# EasyEDA Pro project fan_2024-11-08_no1.eprj

# Schematic Schematic1
Board Name: Board1; Create Date: 2024-11-08; Page Name: P1; Project Name: fan_2024-11-08_no1; Schematic Name: Schematic1; Update Date: 2024-11-09; Company: 嘉立创EDA; Page Size: A4; Version: V1.0
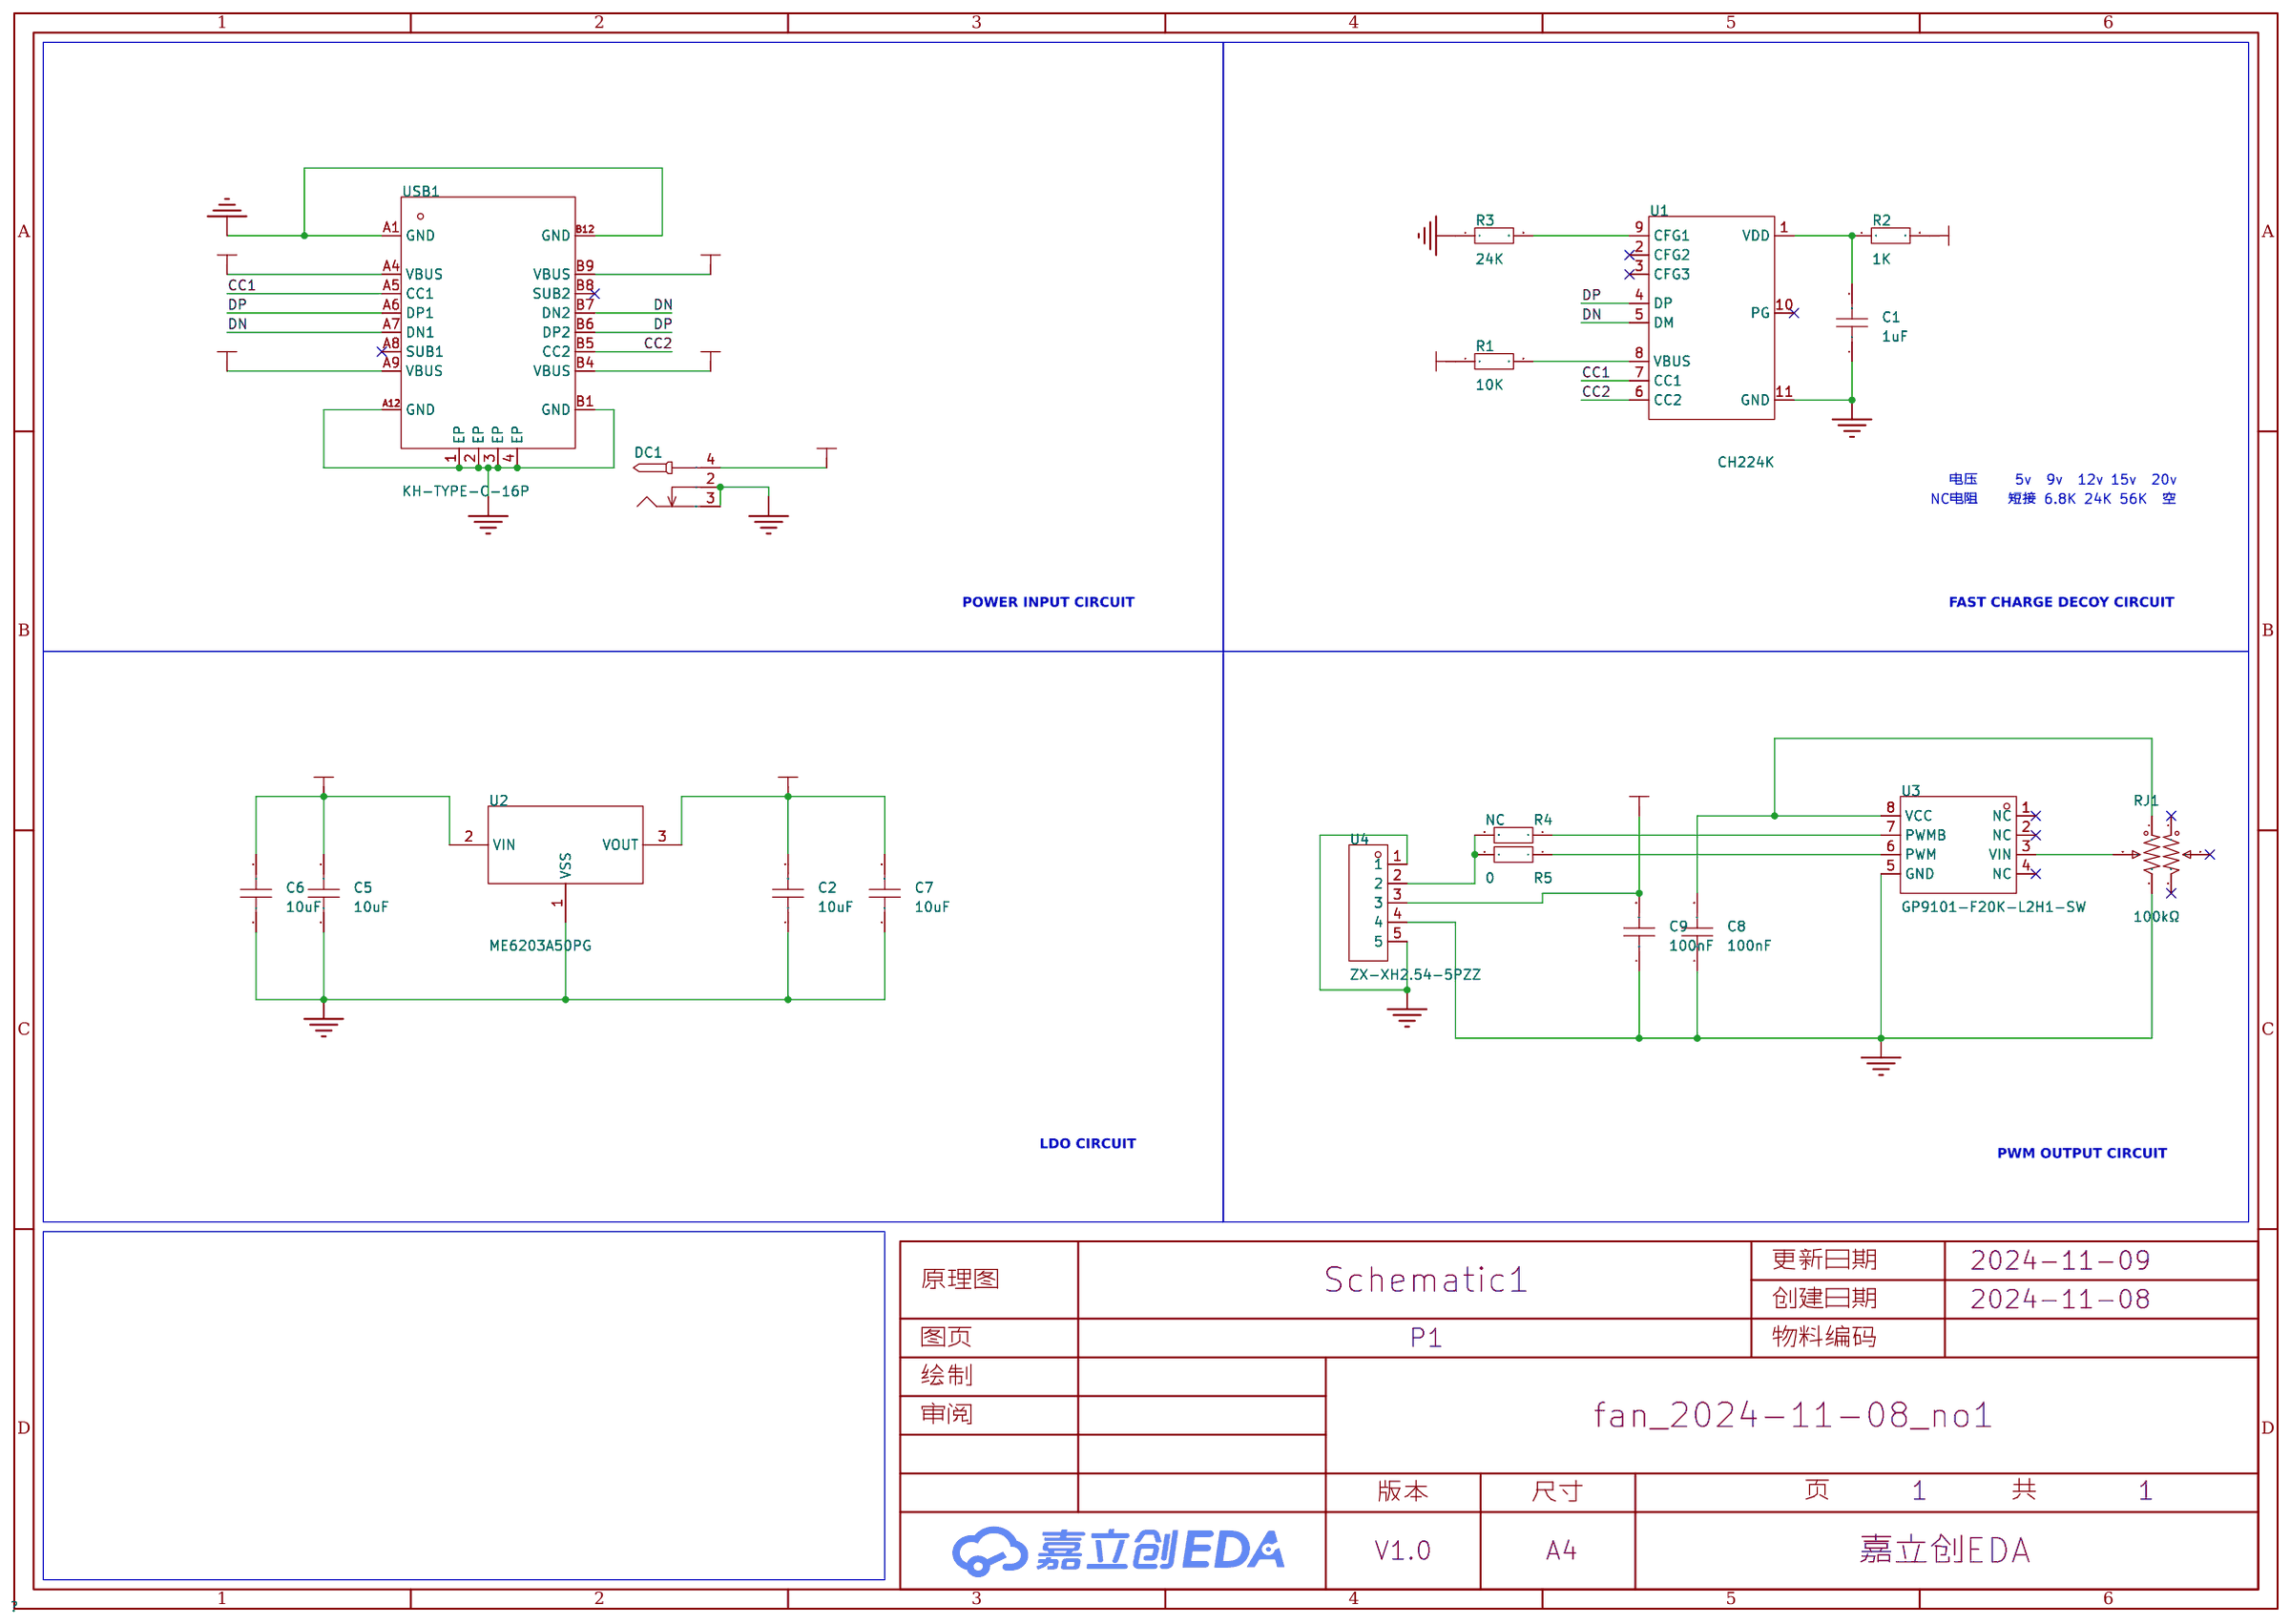
[diagram p0: schematic sheet]

## Parts
C1  1uF  [C0603]
C2  10uF  [C0603]
C5  10uF  [C0603]
C6  10uF  [C0603]
C7  10uF  [C0603]
C8  100nF  [C0603]
C9  100nF  [C0603]
DC1  -  [DC-2.0]
R1  10K  [R0603]
R2  1K  [R0603]
R3  24K  [R0603]
R4  NC  [R0603]
R5  0  [R0603]
RJ1  100kΩ  [RES-ADJ-TH_P092N-FC25CR100K]
U1  CH224K  [ESSOP-10_L4.9-W3.9-P1.0-LS6.0-TL-EP]
U2  ME6203A50PG  [SOT-89_L4.5-W2.5-P1.50-LS4.2-BR]
U3  GP9101-F20K-L2H1-SW  [SOP-8_L5.0-W3.9-P1.27-LS6.0-BL]
U4  ZX-XH2.54-5PZZ  [CONN-TH_5P-P2.50_ZX-XH2.54-5PZZ]
USB1  KH-TYPE-C-16P  [USB-C-SMD_KH-TYPE-C-16P]

## Library data of the parts
C1 C2 C5-C9 = CAP_0603: Supplier Footprint: 0603
DC1 = DC-005_2.0: Supplier Footprint: 插件
R1-R5 = Res_0603: Supplier Footprint: 0603
RJ1 = P092N-FC25CR100K: 阻值:100kΩ;精度:±20%;功率:25mW;; LCSC Part Name: 100kΩ ±20%; Supplier Part: C5840161; Manufacturer: TT Electronics; JLCPCB Part Class: 扩展库; Datasheet: https://atta.szlcsc.com/upload/public/pdf/source/231023/C17276885-5f2621a93e6f587478ebfbf97ba7ec06.pdf; Supplier: LCSC; Tolerance: ±20%; Power(Watts): 25mW; Turns: 1
U1 = CH224K: 应用功能:USB充电芯片;; LCSC Part Name: USB PD等多快充协议受电芯片CH224; Supplier Part: C970725; Manufacturer: WCH(南京沁恒); Supplier Footprint: ESSOP-10-150mil-1mm; JLCPCB Part Class: 扩展库; Datasheet: https://atta.szlcsc.com/upload/public/pdf/source/20240313/43C2AFDDBDD1F65B60386D2CCAB0811B.pdf; Supplier: LCSC; Applications Function: USB充电芯片
U2 = ME6203A50PG: 输出类型:固定;最大输入电压:30V;输出电压:5V;最大输出电流:100mA;电源纹波抑制比(PSRR):40dB@(1kHz);输出极性:正极;; LCSC Part Name: 输入30V 输出5V 100mA; Supplier Part: C94056; Manufacturer: MICRONE(南京微盟); Supplier Footprint: SOT-89; JLCPCB Part Class: 扩展库; Datasheet: https://atta.szlcsc.com/upload/public/pdf/source/20170116/1484561288466.pdf; Supplier: LCSC; Output Type: 固定; Maximum Input Voltage: 30V; Output Voltage: 5V; MAX Output Current: 100mA; Power Supply Rejection Ratio (PSRR): 40dB@(1kHz); Output Polarity: 正极; Number of Outputs: 1
U3 = GP9101-F20K-L2H1-SW: LCSC Part Name: 模拟信号转PWM信号; Supplier Part: C2837710; Manufacturer: Guestgood(客益); Supplier Footprint: SOP-8; JLCPCB Part Class: 扩展库; Datasheet: https://atta.szlcsc.com/upload/public/pdf/source/20230324/347DFD6DABD5C2E507926BD64C336E27.pdf; Supplier: LCSC
U4 = ZX-XH2.54-5PZZ: 插针结构:1x5P;间距:2.54mm;安装方式:直插;参考系列:XH;总PIN数:5P;排数:1;每排PIN数:5;行距:-;额定电流:3A;触头材质:黄铜;触头镀层:锡;工作温度范围:-25℃~+85℃;; Supplier Part: C7429635; Manufacturer: Megastar(兆星); Supplier Footprint: 插件,P=2.54mm; JLCPCB Part Class: 扩展库; Datasheet: https://atta.szlcsc.com/upload/public/pdf/source/20230619/60EEF4ADD558E90BFFACF5D939816781.pdf; Supplier: LCSC; Pins Structure: 1x5P; Pitch: 2.54mm; Mounting Style: 直插; Reference Series: XH; Number of Pins: 5P; Number of Rows: 1; Number of PINs Per Row: 5; Current Rating (Max): 3A; Contact Material: 黄铜; Contact Plating: 锡; Operating Temperature Range: -25℃~+85℃
USB1 = KH-TYPE-C-16P: 连接器类型:Type-C;标准:-;公母:母;端口数量:1;触点数量:16P;安装方式:卧贴;额定电流 - 电源:3A;工作温度范围:-40℃~+85℃;; LCSC Part Name: Type-C 母 卧贴; Supplier Part: C709357; Manufacturer: kinghelm(金航标); Supplier Footprint: SMD; JLCPCB Part Class: 扩展库; Datasheet: https://atta.szlcsc.com/upload/public/pdf/source/20200911/C709357_AA8DCEB38BB20E3035A7ED7AE7667837.pdf; Supplier: LCSC; Connector Type: Type-C; Gender: 母; Number of Ports: 1; Number of Contacts: 16P; Mounting Style: 卧贴; Current Rating - Power (Max): 3A; Operating Temperature Range: -40℃~+85℃

## Nets
+5V: C2.2 C7.2 U2.3(VOUT)
+12V: C5.2 C6.2 C9.2 U2.2(VIN) U4.3
GND: C1.1 C2.1 C5.1 C6.1 C7.1 C8.1 C9.1 DC1.2 DC1.3 R3.1 RJ1.6 U1.11(GND) U2.1(VSS) U3.5(GND) U4.1 U4.4 U4.5 USB1.1(EP) USB1.2(EP) USB1.3(EP) USB1.4(EP) USB1.A1(GND) USB1.A12(GND) USB1.B1(GND) USB1.B12(GND)
VBUS: DC1.4 R1.1 R2.2 USB1.A4(VBUS) USB1.A9(VBUS) USB1.B4(VBUS) USB1.B9(VBUS)
CC1: U1.7(CC1) USB1.A5(CC1)
CC2: U1.6(CC2) USB1.B5(CC2)
DN: U1.5(DM) USB1.A7(DN1) USB1.B7(DN2)
DP: U1.4(DP) USB1.A6(DP1) USB1.B6(DP2)
$1N1243: C1.2 R2.1 U1.1(VDD)
$1N1575: R3.2 U1.9(CFG1)
$1N1579: R1.2 U1.8(VBUS)
$1N5208: RJ1.5 U3.3(VIN)
$1N5444: R4.1 U3.7(PWMB)
$1N5448: R5.1 U3.6(PWM)
$1N5453: R4.2 R5.2 U4.2
$1N5497: C8.2 RJ1.4 U3.8(VCC)

Not connected (* = marked no-connect by the designer): RJ1 1* 2* 3*; U1 2(CFG2)* 3(CFG3)* 10(PG)*; U3 1(NC)* 2(NC)* 4(NC)*; USB1 A8(SUB1)* B8(SUB2)*

## Notes on the sheet
- 电压     5v  9v  12v 15v  20v
- NC电阻    短接 6.8K 24K 56K  空
- POWER INPUT CIRCUIT
- FAST CHARGE DECOY CIRCUIT
- LDO CIRCUIT
- PWM OUTPUT CIRCUIT

# Board PCB1
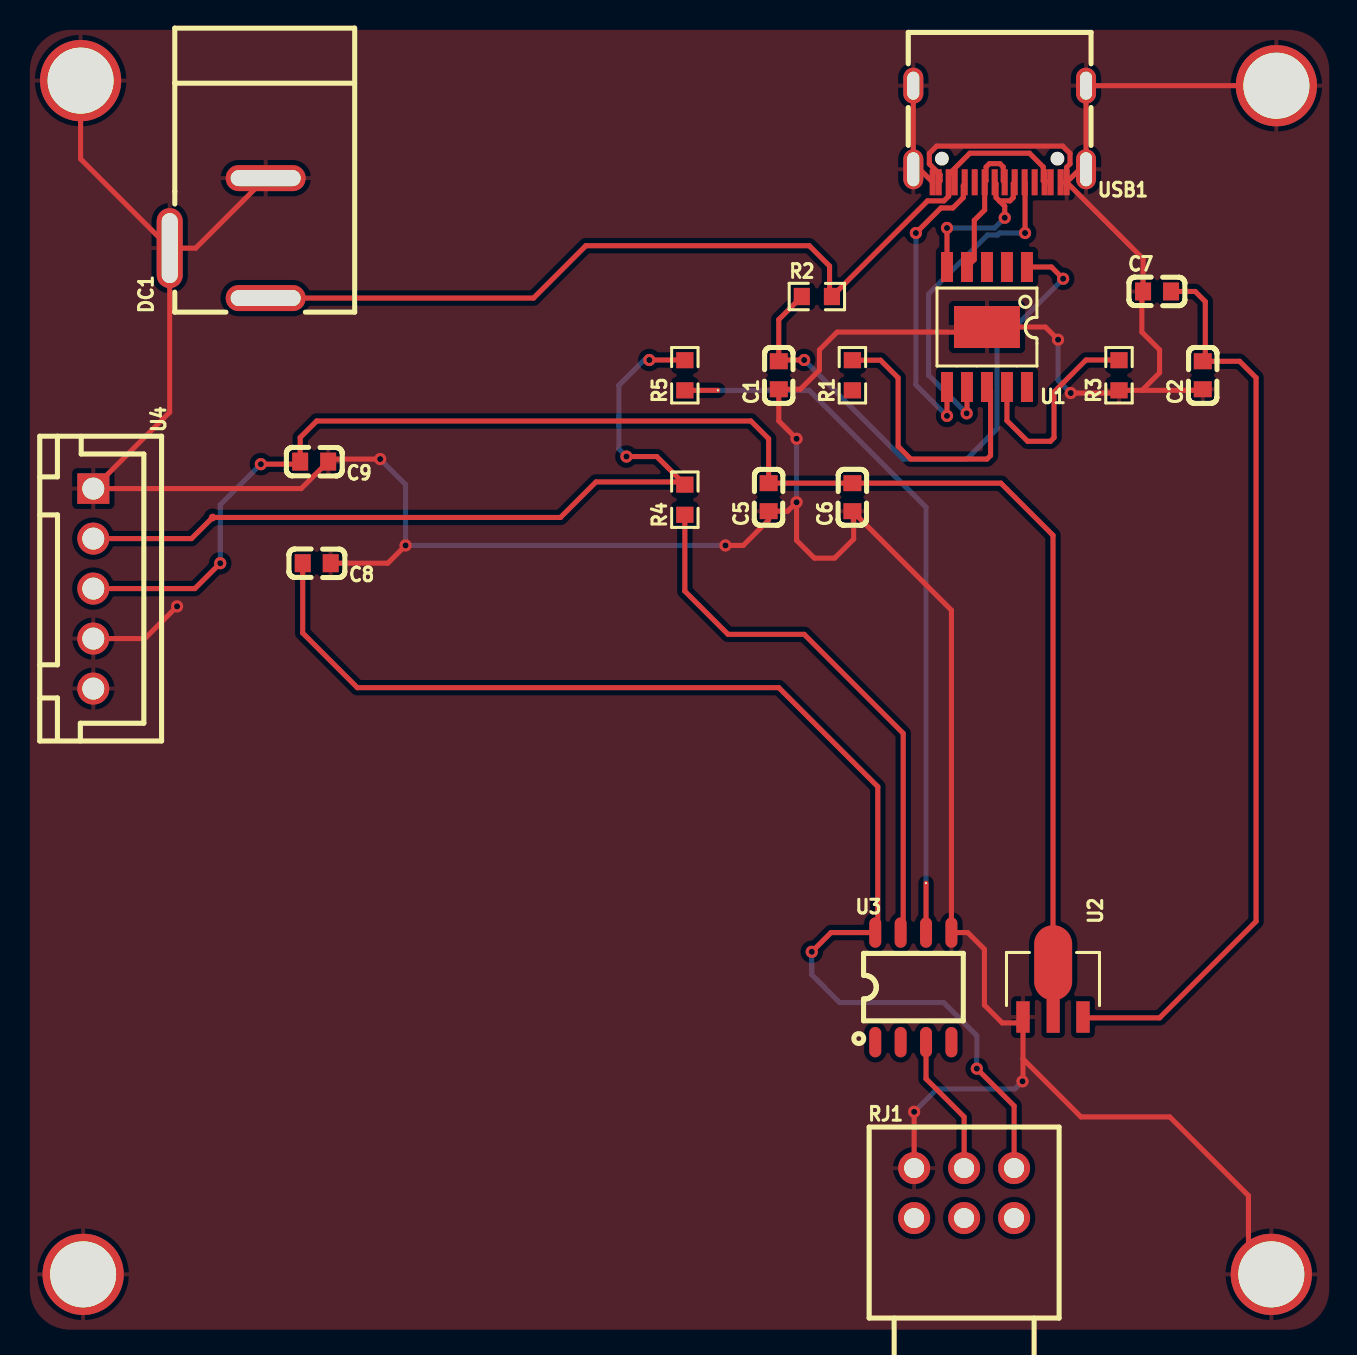
[diagram p1: board, top side]
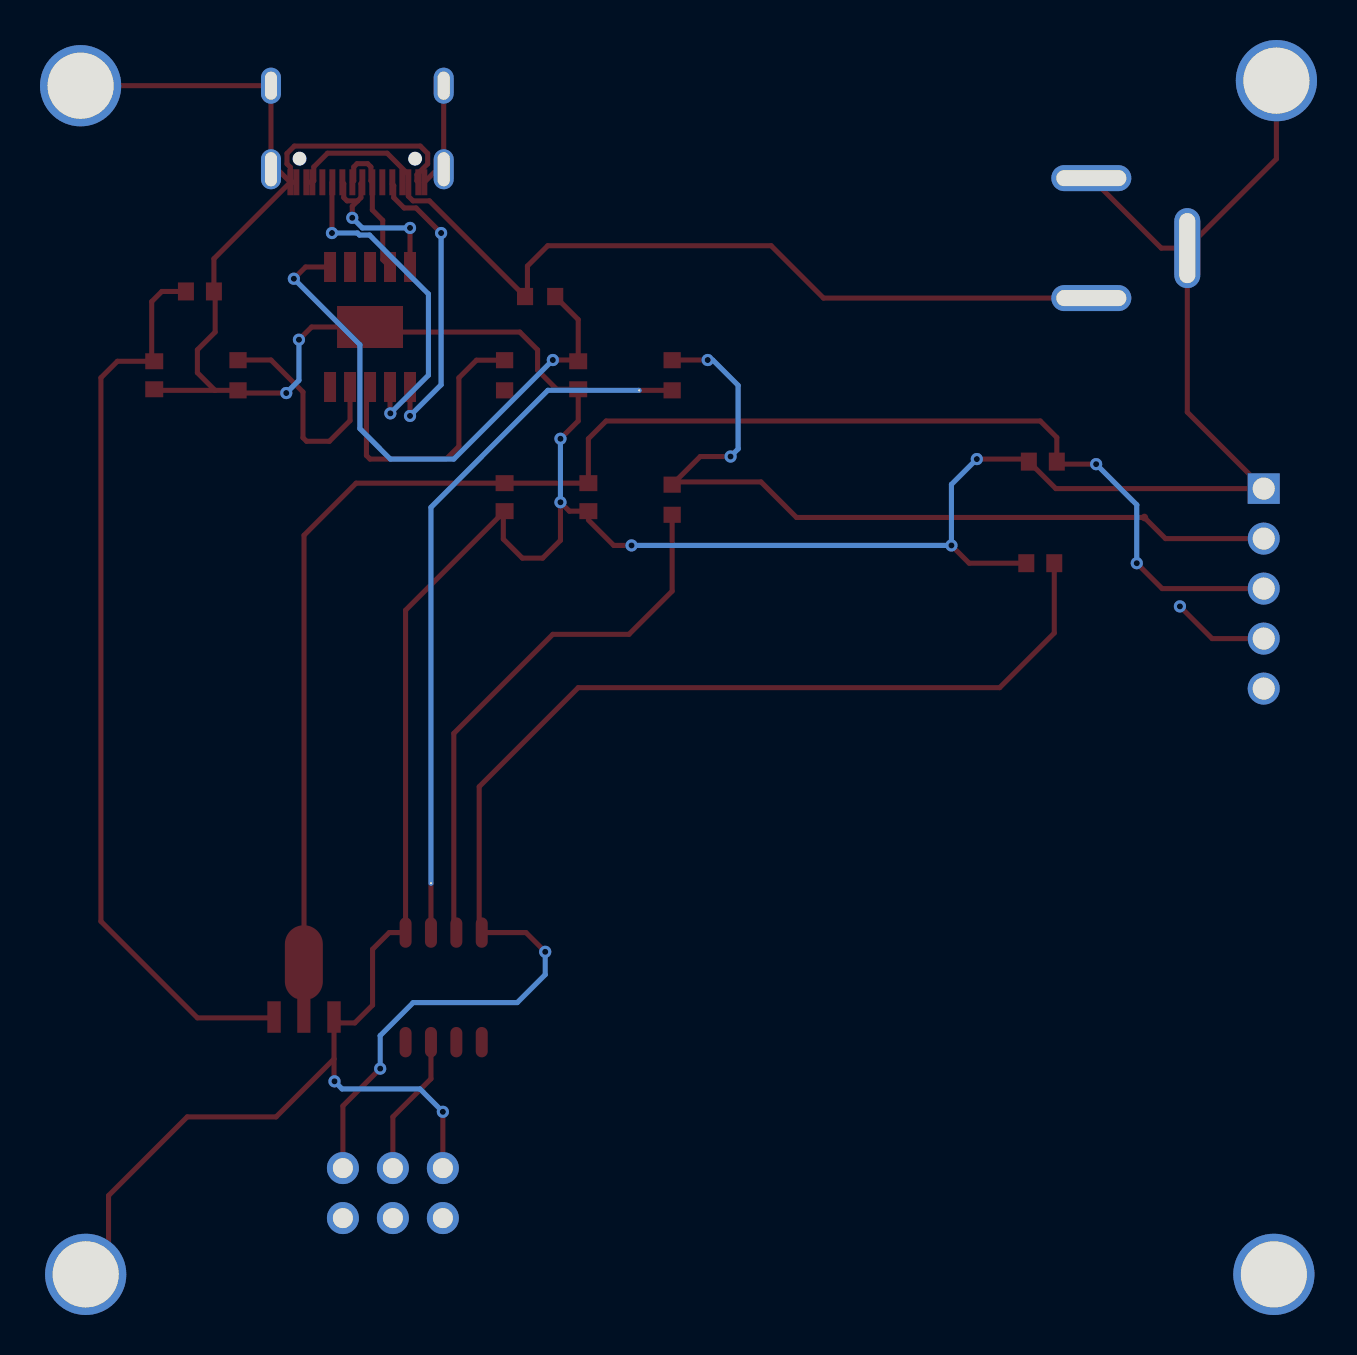
[diagram p2: board, bottom side, seen from below]

Outline 6.47 x 0.69 mm; copper layers: Top Layer, Bottom Layer. Coordinates in mm from the lower left corner of the outline.
Stack: Top Layer 0.035mm / Dielectric1 1.51mm FR4 er 4.5 / Bottom Layer 0.035mm

## Design rules (mm)
template: 自定义配置
spacing copperThickness1oz (default): track to track 0.102, other pairs 0.152 to 0.3
spacing copperThickness2oz: track to track 0.203, other pairs 0.152 to 0.3
track width copperThickness1oz (default): min 0.127, default 0.254, max 2.54
track width copperThickness2oz: min 0.203, default 0.254, max 2.54
differential pair differentialPair (default): width min 0.127, default 0.254, max 2.54; gap min 0.152, default 0.152
via viaSize (default): diameter min 0.5, default 0.61, max 10; hole min 0.3, default 0.305, max 6.3

## Placement (name value [footprint] x y rotation side)
C1  1uF  [C0603]  -7.81 -10.48 90 top
C2  10uF  [C0603]  13.4 -10.48 90 top
C5  10uF  [C0603]  -8.32 -16.58 90 top
C6  10uF  [C0603]  -4.13 -16.58 90 top
C7  10uF  [C0603]  11.11 -6.29 0 top
C8  100nF  [C0603]  -30.93 -19.88 180 top
C9  100nF  [C0603]  -31.05 -14.8 180 top
DC1  -  [DC-2.0]  -33.21 -3.5 90 top
NOREF  -  [Pad_e445]  16.83 -55.44 0 top
NOREF#2  -  [Pad_e69]  -36.13 -17.59 0 top
NOREF#3  -  [Pad_e41]  -10.86 -11.24 0 top
NOREF#4  -  [Pad_e444]  17.08 4 0 top
NOREF#5  -  [Pad_e103]  -35.75 -19.88 0 top
NOREF#6  -  [Pad_e64]  -36.13 -17.59 0 top
NOREF#7  -  [Pad_e443]  -42.61 -55.44 0 top
NOREF#8  -  [Pad_e60]  -15.43 -14.55 0 top
NOREF#9  -  [Pad_e441]  -42.74 4.25 0 top
NOREF#10  -  [Pad_e46]  -0.45 -35.88 0 top
R1  10K  [R0603]  -4.13 -10.48 90 top
R2  1K  [R0603]  -5.91 -6.55 0 top
R3  24K  [R0603]  9.21 -10.48 90 top
R4  NC  [R0603]  -12.51 -16.71 90 top
R5  0  [R0603]  -12.51 -10.48 90 top
RJ1  100kΩ  [RES-ADJ-TH_P092N-FC25CR100K]  1.46 -51.38 0 top
U1  CH224K  [ESSOP-10_L4.9-W3.9-P1.0-LS6.0-TL-EP]  2.6 -8.07 180 top
U2  ME6203A50PG  [SOT-89_L4.5-W2.5-P1.50-LS4.2-BR]  5.9 -41.22 270 top
U3  GP9101-F20K-L2H1-SW  [SOP-8_L5.0-W3.9-P1.27-LS6.0-BL]  -1.08 -41.09 0 top
U4  ZX-XH2.54-5PZZ  [CONN-TH_5P-P2.50_ZX-XH2.54-5PZZ]  -42.1 -21.15 270 top
USB1  KH-TYPE-C-16P  [USB-C-SMD_KH-TYPE-C-16P]  3.24 1.58 180 top

## Footprints (pads in the part's own frame, mm; a bottom-side part is the same pattern mirrored in y, then rotated)
C0603
  rect 0.8x0.9 smd: 1(-0.7,0) 2(0.7,0)
CONN-TH_5P-P2.50_ZX-XH2.54-5PZZ
  rect 1.524x1.6 hole 1.1: 1(-5,0)
  round 1.6 hole 1.1: 2(-2.5,0) 3(0,0) 4(2.5,0) 5(5,0)
DC-2.0
  oval 4x1.3 hole 3.5x0.8: 2(-0.627,5.067)
  oval 1.3x4 hole 0.8x3.5: 3(2.873,0.267) 4(-3.127,0.267)
ESSOP-10_L4.9-W3.9-P1.0-LS6.0-TL-EP
  rect 0.6x1.5 smd: 1(-2,-3) 2(-1,-3) 3(0,-3) 4(1,-3) 5(2,-3) 6(2,3) 7(1,3) 8(0,3) 9(-1,3) 10(-2,3)
  rect 3.3x2.1 smd: 11(0,0)
Pad_e41
  round 0.127 hole 0.102: 1(0,0)
Pad_e46
  round 0.127 hole 0.102: 1(0,0)
Pad_e60
  round 0.127 smd far side: 1(0,0)
Pad_e64
  round 0.127 smd: 1(0,0)
Pad_e69
  round 0.381 smd: 1(0,0)
Pad_e103
  round 0.381 smd: 1(0,0)
Pad_e441
  round 4.064 hole 3.302: 1(0,0)
Pad_e443
  round 4.064 hole 3.302: 1(0,0)
Pad_e444
  round 4.064 hole 3.302: 2(0,0)
Pad_e445
  round 4.064 hole 3.302: 3(0,0)
R0603
  rect 0.806x0.864 smd: 1(-0.753,0) 2(0.753,0)
RES-ADJ-TH_P092N-FC25CR100K
  round 1.6 hole 1: 1(2.5,-1.25) 2(0,-1.25) 3(-2.5,-1.25) 4(2.5,1.25) 5(0,1.25) 6(-2.5,1.25)
SOP-8_L5.0-W3.9-P1.27-LS6.0-BL
  oval 0.6x1.52 smd: 1(-1.905,-2.74) 2(-0.635,-2.74) 3(0.635,-2.74) 4(1.905,-2.74) 5(1.905,2.74) 6(0.635,2.74) 7(-0.635,2.74) 8(-1.905,2.74)
SOT-89_L4.5-W2.5-P1.50-LS4.2-BR
  rect 1.575x0.672 smd: 1(1.356,-1.5) 3(1.356,1.5)
  custom 5.377x1.9 smd: 2(-1.356,0.009)
USB-C-SMD_KH-TYPE-C-16P
  oval 1x2 hole 0.6x1.7: 1(-4.32,1.765) 2(4.32,1.765)
  oval 1x1.8 hole 0.6x1.4: 3(-4.32,-2.415) 4(4.32,-2.415)
  rect 0.3x1.3 smd: A1(-3.35,2.415) A4(-2.55,2.415) A5(-1.25,2.415) A6(-0.25,2.415) A7(0.25,2.415) A8(1.25,2.415) A9(2.55,2.415) A12(3.35,2.415) B1(3.05,2.415) B4(2.25,2.415) B5(1.75,2.415) B6(0.75,2.415) B7(-0.75,2.415) B8(-1.75,2.415) B9(-2.25,2.415) B12(-3.05,2.415)

## Nets
+5V: C2.2 C7.2 U2.3
+12V: C5.2 C6.2 C9.2 NOREF#5.1 U2.2 U4.3
GND: C1.1 C2.1 C5.1 C6.1 C7.1 C8.1 C9.1 DC1.2 DC1.3 NOREF.3 NOREF#4.2 NOREF#7.1 NOREF#9.1 R3.1 RJ1.6 U1.11 U2.1 U3.5 U4.1 U4.4 U4.5 USB1.1 USB1.2 USB1.3 USB1.4 USB1.A1 USB1.A12 USB1.B1 USB1.B12
VBUS: DC1.4 R2.2 USB1.A4 USB1.A9 USB1.B4 USB1.B9
VCC: R1.1
CC1: U1.7 USB1.A5
CC2: U1.6 USB1.B5
DN: U1.5 USB1.A7 USB1.B7
DP: U1.4 USB1.A6 USB1.B6
$1N1243: C1.2 R2.1 U1.1
$1N1575: R3.2 U1.9
$1N1579: R1.2 U1.8
$1N5208: RJ1.5 U3.3
$1N5444: R4.1 U3.7
$1N5448: NOREF#3.1 NOREF#10.1 R5.1 U3.6
$1N5453: NOREF#2.1 NOREF#6.1 NOREF#8.1 R4.2 R5.2 U4.2
$1N5497: C8.2 RJ1.4 U3.8

Pads without a net: RJ1 1 2 3; U1 2 3 10; U3 1 2 4; USB1 A8 B8

## Via types
v1: diameter 0.61, hole 0.305, Top Layer to Bottom Layer, 24 vias

## Routing (per net, layer and track width the routed paths; a pad name or vN(x,y) marks a point on that pad's centre or on a via; arc(x,y) is an arc through that point)
+5V: length 45.8
  Top Layer w0.254: C7.2 13.02,-6.29 13.52,-6.8 13.52,-9.66 C2.2 15.24,-9.78 16.06,-10.61 16.06,-37.79 11.24,-42.61 7.45,-42.61 U2.3
+12V: length 78.9
  Top Layer w0.254: U2.2 5.9,-39.85 5.9,-18.48 3.3,-15.88 C6.2 C5.2 -8.32,-13.66 -9.21,-12.77 -30.93,-12.77 -31.75,-13.6 C9.2 -31.88,-14.93 v1(-33.72,-14.93) ; U4.3 -37.02,-21.15 v1(-35.75,-19.88)
  Bottom Layer w0.254: v1(-35.75,-19.88) -35.75,-16.96 v1(-33.72,-14.93)
GND: length 222.6
  Top Layer w0.254: U4.4 -39.52,-23.65 v1(-37.91,-22.04) ; v1(-10.48,-18.99) -9.59,-18.99 -8.32,-17.72 ; 10.36,-11.24 13.34,-11.24 13.4,-11.18 ; 10.36,-11.24 R3.1 9.07,-11.37 v1(6.79,-11.37) ; 10.36,-11.24 11.24,-10.36 11.24,-9.21 10.35,-8.32 10.35,-6.35 C7.1 10.41,-4.66 USB1.A1 ; DC1.2 -42.74,0.33 NOREF#9.1 ; DC1.2 -36.98,-4.13 DC1.3 ; DC1.2 -38.28,-12.33 U4.1 -31.7,-16.15 C9.1 -30.23,-14.67 v1(-27.75,-14.67) ; USB1.A1 USB1.B12 ; USB1.A1 7.24,-0.18 USB1.1 USB1.3 17.08,4 NOREF#4.2 ; USB1.A1 6.59,-0.08 6.76,0.09 6.76,0.61 6.39,0.98 0.09,0.98 -0.28,0.61 -0.28,0.09 0.26,-0.45 0.26,-0.76 USB1.B1 ; USB1.4 USB1.2 -0.76,-0.18 USB1.A12 ; C5.1 -7.37,-17.28 v1(-6.92,-16.83) -6.92,-18.74 -6.03,-19.63 -5.02,-19.63 -4.07,-18.67 -4.07,-17.34 ; v1(-6.92,-13.66) -7.81,-12.77 -7.81,-11.18 -6.73,-11.18 -5.78,-10.23 -5.78,-9.21 -4.89,-8.32 2.35,-8.32 U1.11 5.52,-8.07 v1(6.16,-8.7) ; -4.07,-17.34 0.82,-22.23 U3.5 1.64,-38.35 2.48,-39.18 2.48,-41.98 3.36,-42.87 4.11,-42.87 U2.1 4.4,-44.67 ; -4.07,-17.34 C6.1 ; 4.4,-44.67 7.3,-47.57 11.75,-47.57 15.68,-51.5 15.68,-54.3 NOREF.3 ; 4.4,-44.67 4.4,-45.76 v1(4.38,-45.79) ; C8.1 -27.37,-19.88 v1(-26.48,-18.99) ; RJ1.6 v1(-1.04,-47.31)
  Bottom Layer w0.254: v1(-27.75,-14.67) -26.48,-15.94 v1(-26.48,-18.99) v1(-10.48,-18.99) ; v1(4.38,-45.79) 4,-46.17 0.1,-46.17 v1(-1.04,-47.31) ; v1(6.79,-11.37) 6.16,-10.74 v1(6.16,-8.7) ; v1(-6.92,-13.66) v1(-6.92,-16.83)
VBUS: length 46.8
  Top Layer w0.254: USB1.A4 USB1.B9 5.42,-0.76 5.42,-0.07 4.73,0.62 1.75,0.62 0.69,-0.44 USB1.A9 0.69,-1.53 0.45,-1.76 -0.37,-1.76 R2.2 -5.27,-6.43 -5.27,-5.02 -6.29,-4.01 -17.46,-4.01 -20.08,-6.62 DC1.4
CC1: length 16.7
  Top Layer w0.254: U1.7 1.6,-12.37 v1(1.59,-12.39) ; v1(4.51,-3.37) 4.51,-0.85 USB1.A5
  Bottom Layer w0.254: v1(1.59,-12.39) -0.32,-10.48 -0.32,-6.42 2.63,-3.47 3.13,-3.47 3.23,-3.37 v1(4.51,-3.37)
CC2: length 15.1
  Top Layer w0.254: v1(-0.95,-3.37) 0.3,-2.12 0.9,-2.12 1.42,-1.6 1.42,-1 1.49,-0.93 USB1.B5 ; U1.6 v1(0.6,-12.51)
  Bottom Layer w0.254: v1(0.6,-12.51) -0.95,-10.96 v1(-0.95,-3.37)
DN: length 8.6
  Top Layer w0.254: 3.22,-1.76 3.75,-1.76 3.92,-1.6 3.92,-0.9 USB1.B7 ; 3.22,-1.76 3.06,-1.6 3.06,-0.9 USB1.A7 ; 3.22,-1.76 3.49,-2.03 v1(3.49,-2.61) ; U1.5 v1(0.6,-3.12)
  Bottom Layer w0.254: v1(3.49,-2.61) 2.98,-3.12 v1(0.6,-3.12)
DP: length 7.2
  Top Layer w0.254: U1.4 1.97,-4.7 1.97,-2.74 2.49,-2.22 USB1.B6 2.56,-0.76 2.56,-0.07 2.72,0.1 3.25,0.1 3.42,-0.07 3.42,-0.76 USB1.A6
$1N1243: length 28.3
  Top Layer w0.254: v1(6.41,-5.66) 5.83,-5.07 U1.1 ; v1(-6.54,-9.72) -7.75,-9.72 C1.2 -7.81,-7.7 R2.1
  Bottom Layer w0.254: v1(-6.54,-9.72) -1.59,-14.67 1.59,-14.67 3.11,-13.15 3.11,-8.96 v1(6.41,-5.66)
$1N1575: length 10.7
  Top Layer w0.254: U1.9 3.6,-12.75 4.63,-13.78 5.78,-13.78 5.96,-13.61 5.96,-11.32 7.56,-9.72 9.2,-9.72 R3.2
$1N1579: length 14.5
  Top Layer w0.254: R1.2 -2.72,-9.73 -1.84,-10.61 -1.84,-14.04 -1.21,-14.67 2.6,-14.67 2.78,-14.49 2.78,-11.25 U1.8
$1N5208: length 7.1
  Top Layer w0.254: U3.3 -0.45,-45.66 1.46,-47.57 RJ1.5
$1N5444: length 27.7
  Top Layer w0.254: R4.1 -12.51,-21.28 -10.35,-23.44 -6.54,-23.44 -1.59,-28.39 -1.59,-38.22 U3.7
$1N5448: length 35.8
  Top Layer w0.254: R5.1 NOREF#3.1 ; NOREF#10.1 U3.6
  Bottom Layer w0.254: NOREF#3.1 -6.3,-11.24 -0.45,-17.09 NOREF#10.1
$1N5453: length 41.7
  Top Layer w0.254: -12.65,-15.82 -16.96,-15.82 -18.73,-17.59 NOREF#2.1 -37.19,-18.65 U4.2 ; -12.65,-15.82 R4.2 ; -12.65,-15.82 -13.92,-14.55 v1(-15.43,-14.55) ; R5.2 -12.52,-9.72 v1(-14.29,-9.72)
  Bottom Layer w0.254: v1(-15.43,-14.55) -15.81,-14.17 -15.81,-10.99 -14.54,-9.72 v1(-14.29,-9.72)
$1N5497: length 64.4
  Top Layer w0.254: v1(2.09,-45.15) 3.96,-47.02 RJ1.4 ; v1(-6.16,-39.31) -5.2,-38.35 U3.8 -2.86,-38.22 -2.86,-31.06 -7.81,-26.1 -28.89,-26.1 -31.63,-23.37 C8.2
  Bottom Layer w0.254: v1(-6.16,-39.31) -6.16,-40.45 -4.76,-41.85 0.44,-41.85 2.09,-43.5 v1(2.09,-45.15)

## Copper pours and planes (outline as drawn; the poured copper is in the pictures)
GND on Top Layer: -45.28,4.76 -45.27,4.93 -45.22,5.21 -45.14,5.49 -45.02,5.74 -44.87,5.98 -44.68,6.19 -44.47,6.38 -44.23,6.53 -43.97,6.65 -43.7,6.74 -43.42,6.78 -43.24,6.79 17.69,6.79 17.87,6.78 18.15,6.74 18.42,6.65 18.68,6.53 18.91,6.38 19.13,6.19 19.31,5.98 19.47,5.74 19.59,5.49 19.67,5.21 19.72,4.93 19.72,4.76 19.72,-56.18 19.72,-56.36 19.67,-56.64 19.59,-56.91 19.47,-57.16 19.31,-57.4 19.13,-57.62 18.91,-57.8 18.68,-57.96 18.42,-58.08 18.15,-58.16 17.87,-58.2 17.69,-58.21 -43.24,-58.21 -43.42,-58.2 -43.7,-58.16 -43.97,-58.08 -44.23,-57.96 -44.47,-57.8 -44.68,-57.62 -44.87,-57.4 -45.02,-57.16 -45.14,-56.91 -45.22,-56.64 -45.27,-56.36 -45.28,-56.18
